# EAGLE design 2023-12-16 LVMi-IonPump-Controller (EAGLE 9.6.2)
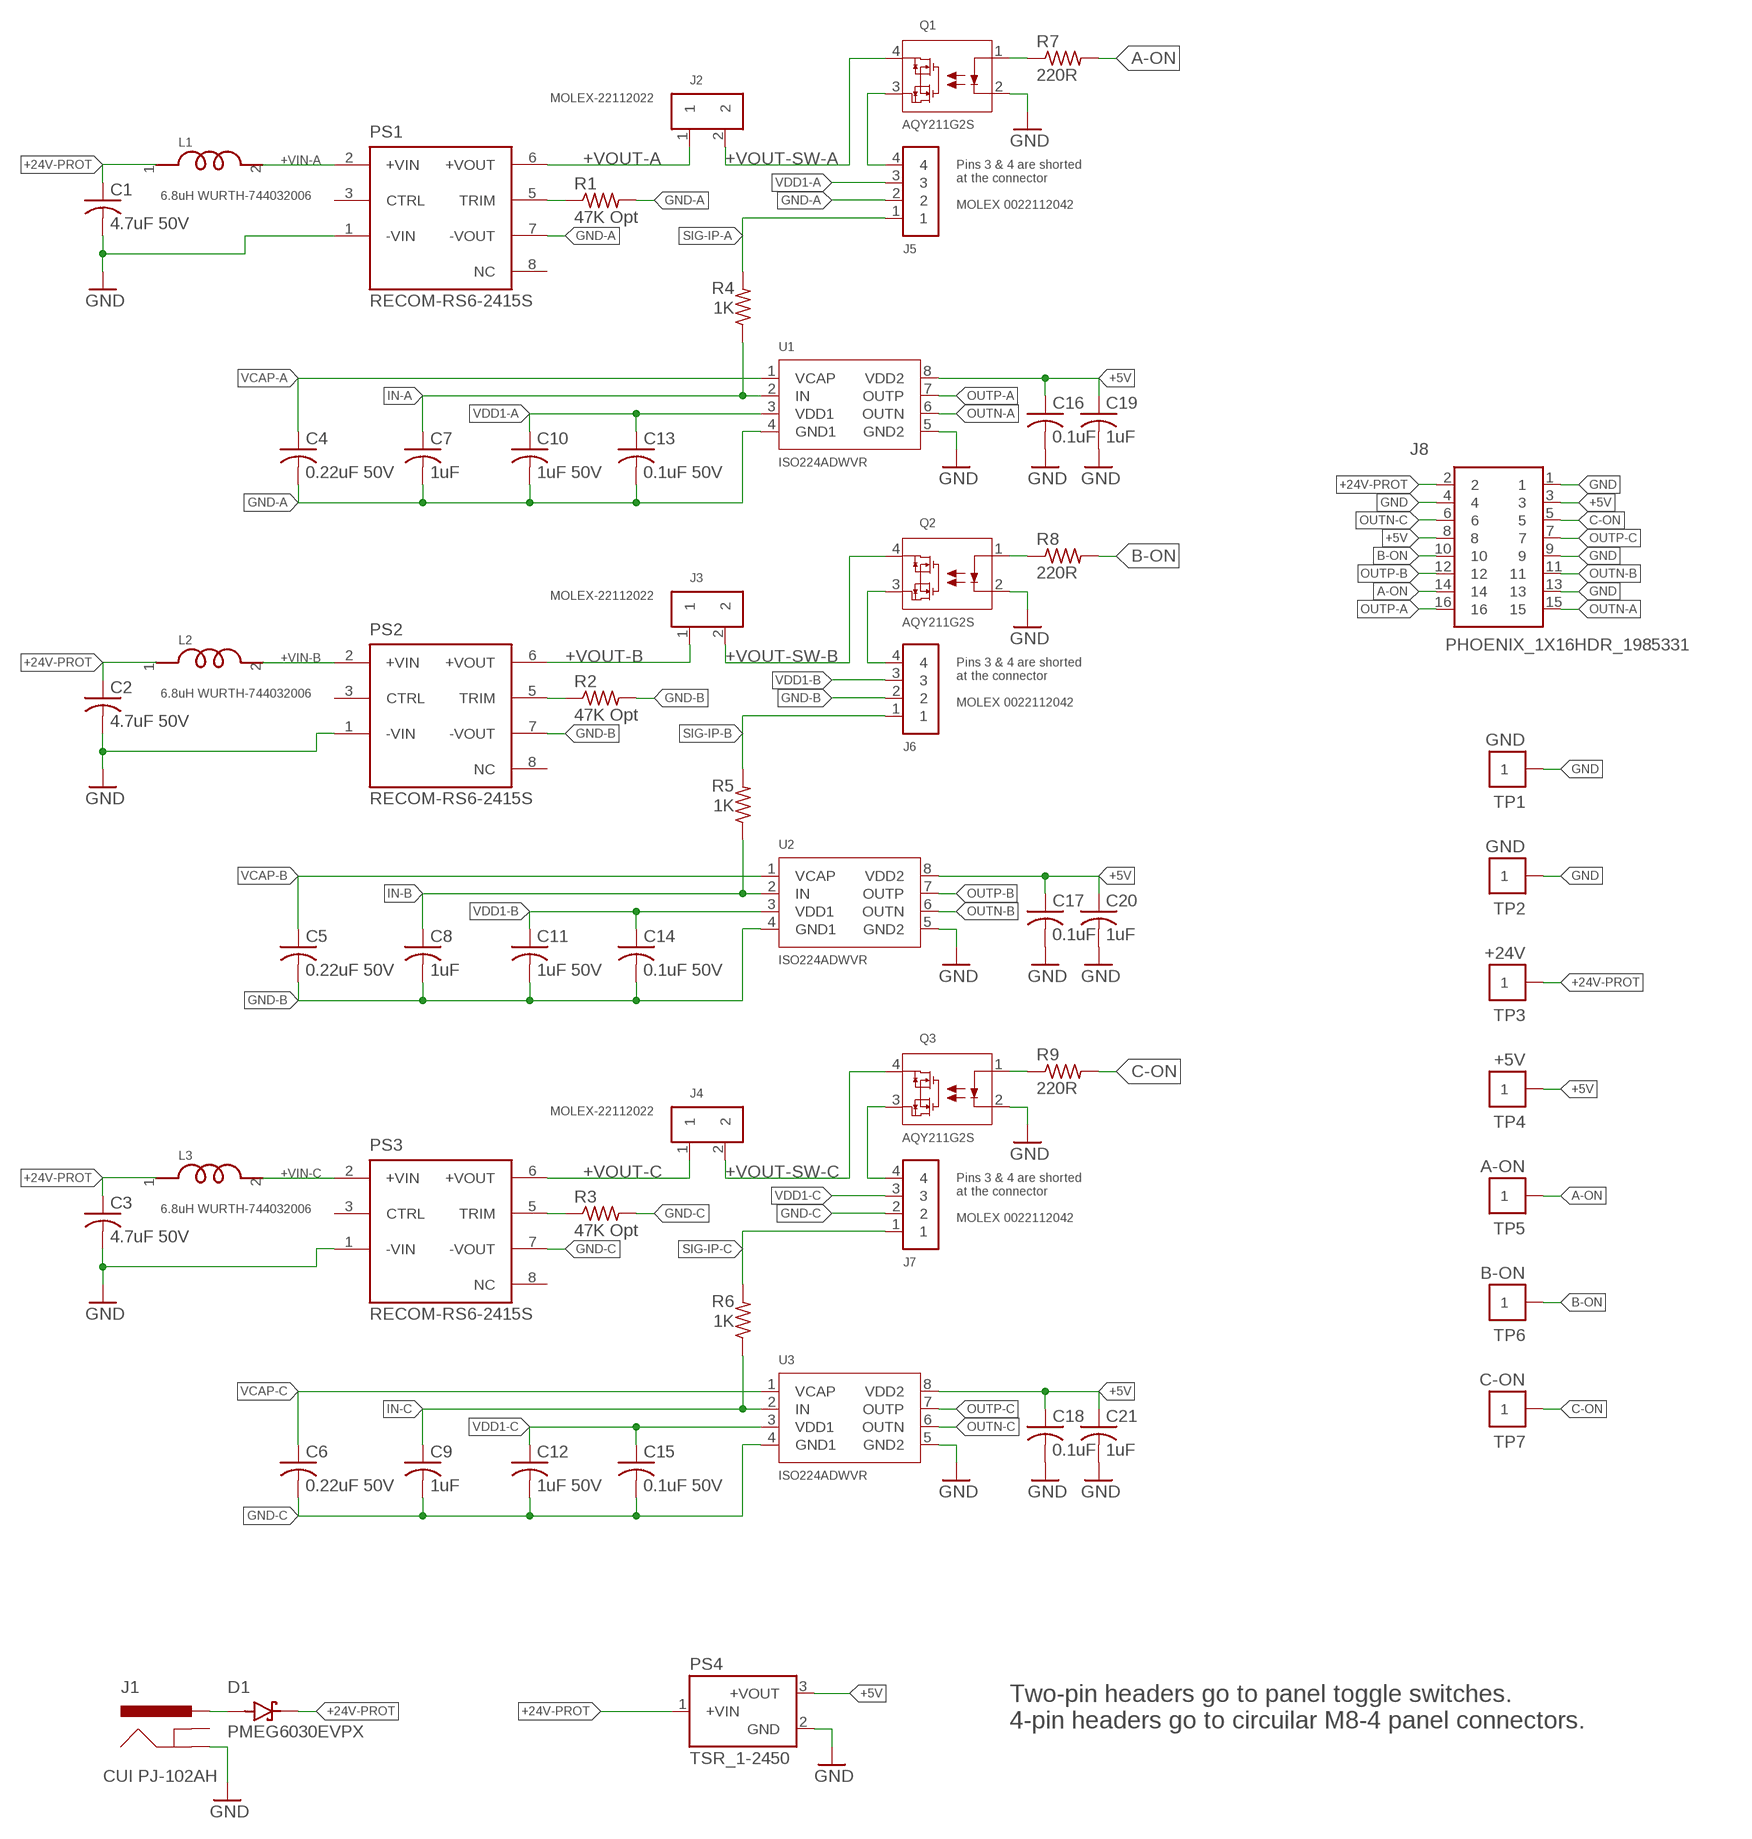
[diagram p0: schematic, sheet 1]

## Parts
C1  4.7uF 50V  C-USC0805  [C0805]
C2  4.7uF 50V  C-USC0805  [C0805]
C3  4.7uF 50V  C-USC0805  [C0805]
C4  0.22uF 50V  C-USC0805  [C0805]
C5  0.22uF 50V  C-USC0805  [C0805]
C6  0.22uF 50V  C-USC0805  [C0805]
C7  1uF  C-USC0805  [C0805]
C8  1uF  C-USC0805  [C0805]
C9  1uF  C-USC0805  [C0805]
C10  1uF 50V  C-USC0805  [C0805]
C11  1uF 50V  C-USC0805  [C0805]
C12  1uF 50V  C-USC0805  [C0805]
C13  0.1uF 50V  C-USC0805  [C0805]
C14  0.1uF 50V  C-USC0805  [C0805]
C15  0.1uF 50V  C-USC0805  [C0805]
C16  0.1uF  C-USC0805  [C0805]
C17  0.1uF  C-USC0805  [C0805]
C18  0.1uF  C-USC0805  [C0805]
C19  1uF  C-USC0805  [C0805]
C20  1uF  C-USC0805  [C0805]
C21  1uF  C-USC0805  [C0805]
D1  PMEG6030EVPX  SCHOTTKY-PMEG6030EVPX  [DIO_PMEG6030EVPX]
J1  CUI PJ-102AH  POWER_JACKPJ-102AH  [PJ-102AH]
J2  MOLEX-22112022  PINHD-1X2-MOLEX-22112022  [1X02-MOLEX-22112022]
J3  MOLEX-22112022  PINHD-1X2-MOLEX-22112022  [1X02-MOLEX-22112022]
J4  MOLEX-22112022  PINHD-1X2-MOLEX-22112022  [1X02-MOLEX-22112022]
J5  MOLEX 0022112042  PINHD-1X4-MOLEX-22112042  [1X04-MOLEX-22112042]
J6  MOLEX 0022112042  PINHD-1X4-MOLEX-22112042  [1X04-MOLEX-22112042]
J7  MOLEX 0022112042  PINHD-1X4-MOLEX-22112042  [1X04-MOLEX-22112042]
J8  PHOENIX_1X16HDR_1985331  [1985331]
L1  6.8uH WURTH-744032006  INDUCTOR-WURTH-744032006  [WURTH-1210-INDUCTOR]
L2  6.8uH WURTH-744032006  INDUCTOR-WURTH-744032006  [WURTH-1210-INDUCTOR]
L3  6.8uH WURTH-744032006  INDUCTOR-WURTH-744032006  [WURTH-1210-INDUCTOR]
PS1  RECOM-RS6-2415S  DC-DC-15V-RECOM-RS6-2415S  [CONV_RS6-2415S]
PS2  RECOM-RS6-2415S  DC-DC-15V-RECOM-RS6-2415S  [CONV_RS6-2415S]
PS3  RECOM-RS6-2415S  DC-DC-15V-RECOM-RS6-2415S  [CONV_RS6-2415S]
PS4  TSR_1-2450  [CONV_TSR_1-2450]
Q1  AQY211G2S  AQY212GSX  [SOP4_PAN]
Q2  AQY211G2S  AQY212GSX  [SOP4_PAN]
Q3  AQY211G2S  AQY212GSX  [SOP4_PAN]
R1  47K Opt  R-US_R0805  [R0805]
R2  47K Opt  R-US_R0805  [R0805]
R3  47K Opt  R-US_R0805  [R0805]
R4  1K  R-US_R0805  [R0805]
R5  1K  R-US_R0805  [R0805]
R6  1K  R-US_R0805  [R0805]
R7  220R  R-US_R0805  [R0805]
R8  220R  R-US_R0805  [R0805]
R9  220R  R-US_R0805  [R0805]
TP1  GND  TP5000-TESTPOINT-BLK  [TP5000-TESTPOINT-BLK]
TP2  GND  TP5000-TESTPOINT-BLK  [TP5000-TESTPOINT-BLK]
TP3  +24V  TP5000-TESTPOINT-BLK  [TP5000-TESTPOINT-BLK]
TP4  +5V  TP5000-TESTPOINT-BLK  [TP5000-TESTPOINT-BLK]
TP5  A-ON  TP5000-TESTPOINT-BLK  [TP5000-TESTPOINT-BLK]
TP6  B-ON  TP5000-TESTPOINT-BLK  [TP5000-TESTPOINT-BLK]
TP7  C-ON  TP5000-TESTPOINT-BLK  [TP5000-TESTPOINT-BLK]
U1  ISO224ADWVR  [DWV8_TEX]
U2  ISO224ADWVR  [DWV8_TEX]
U3  ISO224ADWVR  [DWV8_TEX]

## Nets
+5V: C16.1 C17.1 C18.1 C19.1 C20.1 C21.1 J8.3 J8.8 PS4.3(+VOUT) TP4.P$1 U1.8(VDD2) U2.8(VDD2) U3.8(VDD2)
+24V: D1.2(A) J1.PWR
+24V-PROT: C1.1 C2.1 C3.1 D1.1(K) J8.2 L1.1 L2.1 L3.1 PS4.1(+VIN) TP3.P$1
+VIN-A: L1.2 PS1.2(+VIN)
+VIN-B: L2.2 PS2.2(+VIN)
+VIN-C: L3.2 PS3.2(+VIN)
+VOUT-A: J2.1 PS1.6(+VOUT)
+VOUT-B: J3.1 PS2.6(+VOUT)
+VOUT-C: J4.1 PS3.6(+VOUT)
+VOUT-SW-A: J2.2 Q1.4
+VOUT-SW-B: J3.2 Q2.4
+VOUT-SW-C: J4.2 Q3.4
A-ON: J8.14 R7.2 TP5.P$1
B-ON: J8.10 R8.2 TP6.P$1
C-ON: J8.5 R9.2 TP7.P$1
GND: C1.2 C2.2 C3.2 C16.2 C17.2 C18.2 C19.2 C20.2 C21.2 J1.GND J8.1 J8.4 J8.9 J8.13 PS1.1(-VIN) PS2.1(-VIN) PS3.1(-VIN) PS4.2(GND) Q1.2 Q2.2 Q3.2 TP1.P$1 TP2.P$1 U1.5(GND2) U2.5(GND2) U3.5(GND2)
GND-A: C4.2 C7.2 C10.2 C13.2 J5.2 PS1.7(-VOUT) R1.2 U1.4(GND1)
GND-B: C5.2 C8.2 C11.2 C14.2 J6.2 PS2.7(-VOUT) R2.2 U2.4(GND1)
GND-C: C6.2 C9.2 C12.2 C15.2 J7.2 PS3.7(-VOUT) R3.2 U3.4(GND1)
IN-A: C7.1 R4.1 U1.2(IN)
IN-B: C8.1 R5.1 U2.2(IN)
IN-C: C9.1 R6.1 U3.2(IN)
N$1: Q3.1 R9.1
N$2: Q1.1 R7.1
N$3: Q2.1 R8.1
N$4: PS3.5(TRIM) R3.1
N$5: PS2.5(TRIM) R2.1
N$6: PS1.5(TRIM) R1.1
OUTN-A: J8.15 U1.6(OUTN)
OUTN-B: J8.11 U2.6(OUTN)
OUTN-C: J8.6 U3.6(OUTN)
OUTP-A: J8.16 U1.7(OUTP)
OUTP-B: J8.12 U2.7(OUTP)
OUTP-C: J8.7 U3.7(OUTP)
SIG-IP-A: J5.1 R4.2
SIG-IP-B: J6.1 R5.2
SIG-IP-C: J7.1 R6.2
VCAP-A: C4.1 U1.1(VCAP)
VCAP-B: C5.1 U2.1(VCAP)
VCAP-C: C6.1 U3.1(VCAP)
VDD1-A: C10.1 C13.1 J5.3 U1.3(VDD1)
VDD1-B: C11.1 C14.1 J6.3 U2.3(VDD1)
VDD1-C: C12.1 C15.1 J7.3 U3.3(VDD1)
VOUT-RL-A: J5.4 Q1.3
VOUT-RL-B: J6.4 Q2.3
VOUT-RL-C: J7.4 Q3.3
Unconnected: J1.GNDBRK(GNDBREAK) PS1.3(CTRL) PS1.8(NC) PS2.3(CTRL) PS2.8(NC) PS3.3(CTRL) PS3.8(NC)

## Notes on the sheet
- Pins 3 & 4 are shorted
  at the connector
- Pins 3 & 4 are shorted
  at the connector
- Pins 3 & 4 are shorted
  at the connector
- Two-pin headers go to panel toggle switches.
  4-pin headers go to circuilar M8-4 panel connectors.

## Library data of the parts
C1-C21 = AUmlib:C-US: CAPACITOR, American symbol; SPICEPREFIX: C
D1 = AUmlib:SCHOTTKY-PMEG6030EVPX: PMEG6030 Series 60 V 3 A Surface Mount Schottky Barrier Rectifier - SOD-128; DESCRIPTION: Diode Schottky 60V 3A Surface Mount SOD-128/CFP5; DIGI-KEY_PART_NUMBER: 1727-1349-1-ND; MF: Nexperia USA; MP: PMEG6030EVPX; PACKAGE: CFP5-2 Nexperia USA Inc.; PURCHASE-URL: https://pricing.snapeda.com/search/part/PMEG6030EVPX/?ref=eda
J1 = AUmlib:POWER_JACK: Power Jack Connector The CUI PJ-102AH has smaller tabs and a 2.1 mm opening for a 2.0 mm pin. This is the standard 5.5mm barrel jack for power. The PTH is the most common, proven, reliable, footprint. The Slot footprint only works if the mill layer is transmitted to the PCB fab house so be warned. Here are the connectors we sell at SparkFun: DC Barrel Power Jack/Connector <https://www.sparkfun.com/products/119> (PRT-00119) DC Barrel Power Jack/Connector (SMD) <https://www.sparkfun.com/products/12748> (PRT-12748) DC Barrel Jack Adapter - Breadboard Compatible <https://www.sparkfun.com/products/10811> (PRT-10811) It is used on this SparkFun product (and many, many others): SparkFun RedBoard - Programmed with Arduino <https://www.sparkfun.com/products/12757> (DEV-12757) Also, if you need a mating power supply or connector, please check these out: Wall Adapter Power Supply - 9VDC 650mA <https://www.sparkfun.com/products/298> (TOL-00298) DC Barrel Jack Adapter - Male <https://www.sparkfun.com/products/10287> (PRT-10287)
J2-J4 = AUmlib:PINHD-1X2-MOLEX-22112022
J5-J7 = AUmlib:PINHD-1X4-MOLEX-22112042
J8 = AUmlib:PHOENIX_1X16HDR_1985331: PTSA 1,5/16-3,5-Z Source: Datasheet <https://datasheet.datasheetarchive.com/originals/distributors/SFDatasheet-2/sf-00059086.pdf>; DESCRIPTION: PTSA 1,5/16-3,5-Z; HEIGHT: 13.1mm; MANUFACTURER_NAME: Phoenix Contact; MANUFACTURER_PART_NUMBER: 1985331; MOUSER_PART_NUMBER: 651-1985331; MOUSER_PRICE-STOCK: https://www.mouser.co.uk/ProductDetail/Phoenix-Contact/1985331?qs=uD%2FdkN7XIa2gzzUd7QLZ1Q%3D%3D
L1-L3 = AUmlib:INDUCTOR-WURTH-744032006
PS1-PS3 = AUmlib:DC-DC-15V-RECOM-RS6-2415S: 6 Watt SIP8 Single and Dual Output; DESCRIPTION: 6W DC/DC-Converter 'ECONOLINE' SIP8 2kV reg 2:1; DIGI-KEY_PART_NUMBER: 945-2987-ND; MF: Recom Power; MP: RS6-2415S; PACKAGE: SIP-8 Recom Power; PURCHASE-URL: https://pricing.snapeda.com/search/part/RS6-2415S/?ref=eda
PS4 = AUmlib:TSR_1-2450; MANUFACTURER: Traco Power; MAXIMUM_PACKAGE_HEIGHT: 10.6mm; PARTREV: Apr 27, 2020; STANDARD: Manufacturer Recommendations
Q1-Q3 = AUmlib:AQY212GSX; COPYRIGHT: Copyright (C) 2023 Ultra Librarian. All rights reserved.; MANUFACTURER_PART_NUMBER: AQY212GSX; MFR_NAME: Panasonic
R1-R9 = AUmlib:R-US_: RESISTOR, American symbol; SPICEPREFIX: R
TP1-TP7 = AUmlib:TP5000-TESTPOINT-BLK: TEST POINT
U1-U3 = AUmlib:ISO224ADWVR; BUILT_BY: EMA_Jessica; COPYRIGHT: Copyright (C) 2018 Accelerated Designs. All rights reserved; MANUFACTURER_PART_NUMBER: ISO224ADWVR; SOURCELIBRARY: TI_2020-05-18; VENDOR: Texas Instruments

## Board
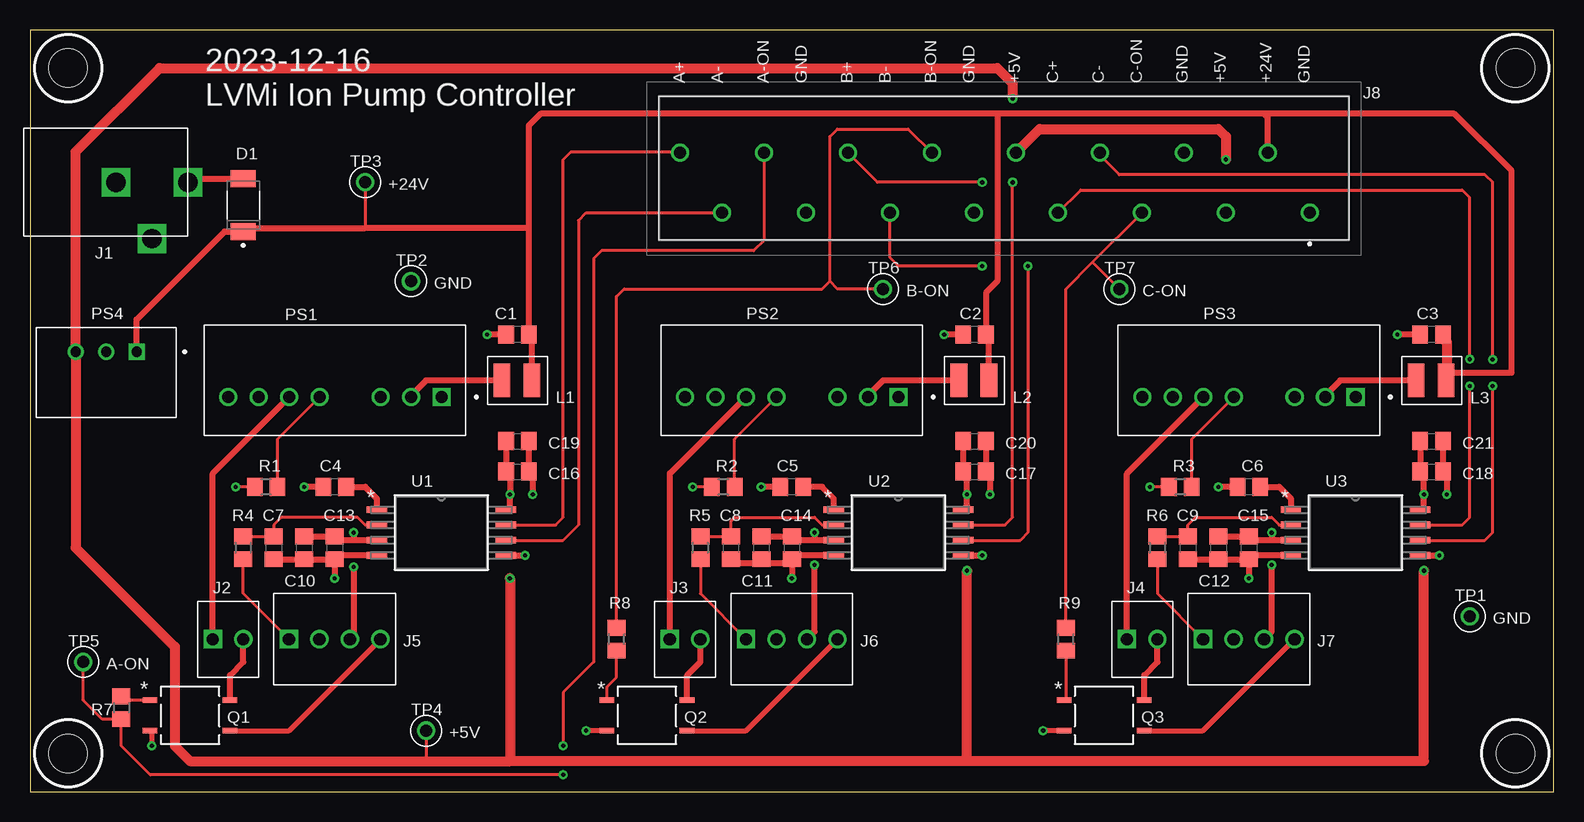
[diagram p1: board, top side]
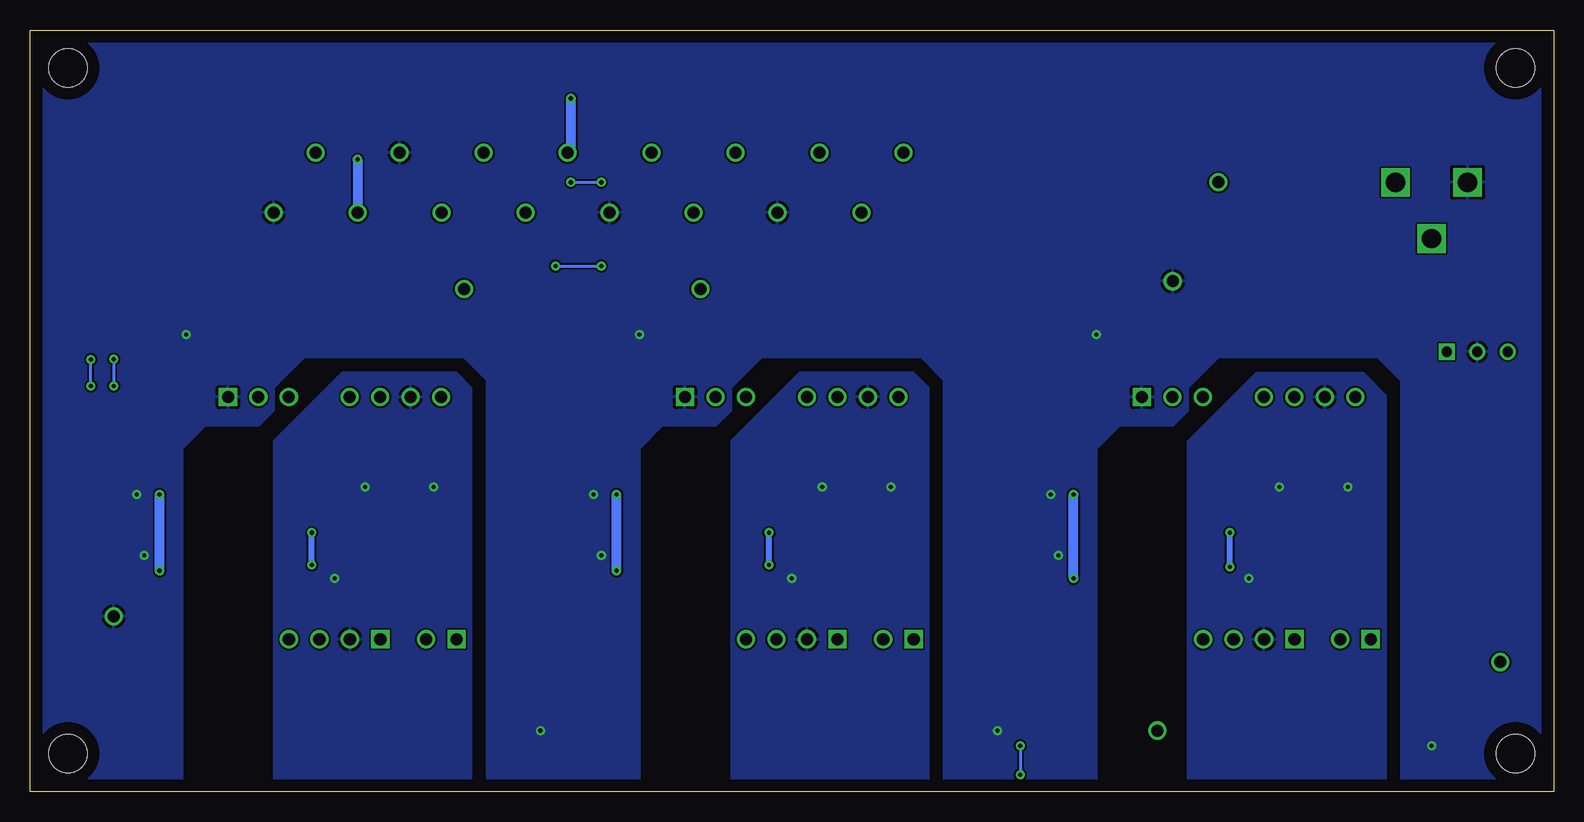
[diagram p2: board, bottom side, seen from below]

Size 127 x 63.5 mm. Coordinates in mm from the lower left corner, seen from the top.
Outline: 0,0 127,0 127,63.5 0,63.5 0,0
Copper layers (1*16): Top 0.035mm / dielectric 1.5mm / Bottom 0.035mm
Design rules "default": minimum track width 6mil, minimum drill 0.35mm, track to track 6mil, track to pad 6mil, pad to pad 6mil, via to via 6mil, smd to smd 6mil, copper to edge 40mil, drill to drill 6mil, minimum pad ring 10mil, minimum via ring 8mil, stop-mask expansion 4mil, vias tented up to drill 0mil, thermal gap 10mil
Holes 3.17 mm at 3.17,3.17 123.83,3.17 123.83,60.33 3.17,60.33

### Footprints (pad centres in the part's own frame; a part is rotated, then mirrored left to right if it is on the bottom)
C0805 = smd 1.3 x 1.5: 1 -0.95,0; 2 0.95,0
DIO_PMEG6030EVPX = smd 1.4 x 2.1: 1 -2.2,0; 2 2.2,0
PJ-102AH = drill 1.6 square: GND 0,3; GNDBRK -4.7,0; PWR 0,-3
1X02-MOLEX-22112022 = drill 1.016 square: 1 -1.27,0 | drill 1.016: 2 1.27,0
1X04-MOLEX-22112042 = drill 1.016 square: 1 0,0 | drill 1.016: 2 2.54,0; 3 5.08,0; 4 7.62,0
1985331 = drill 1 pad 1.5: 1 0,0; 2 3.5,-5; 3 7,0; 4 10.5,-5; 5 14,0; 6 17.5,-5; 7 21,0; 8 24.5,-5; 9 28,0; 10 31.5,-5; 11 35,0; 12 38.5,-5; 13 42,0; 14 45.5,-5; 15 49,0; 16 52.5,-5
WURTH-1210-INDUCTOR = smd 1.4 x 2.8: 1 -1.2,0; 2 1.3,0
CONV_RS6-2415S = drill 1 square: 1 -8.9,1.4 | drill 1: 2 -6.36,1.4; 3 -3.82,1.4; 5 1.26,1.4; 6 3.8,1.4; 7 6.34,1.4; 8 8.88,1.4
CONV_TSR_1-2450 = drill 0.85 square: 1 -2.54,-1.75 | drill 0.85: 2 0,-1.75; 3 2.54,-1.75
SOP4_PAN = smd 1.219 x 0.457: 1 -3.34,1.27; 2 -3.34,-1.27; 3 3.34,-1.27; 4 3.34,1.27
R0805 = smd 1.3 x 1.5: 1 -0.95,0; 2 0.95,0
TP5000-TESTPOINT-BLK = drill 1: P$1 0,0
DWV8_TEX = smd 1.702 x 0.559: 1 -5.385,1.905; 2 -5.385,0.635; 3 -5.385,-0.635; 4 -5.385,-1.905; 5 5.385,-1.905; 6 5.385,-0.635; 7 5.385,0.635; 8 5.385,1.905

### Placement (x,y rotation side)
C1  40.64,38.1 180 top
C2  78.74,38.1 180 top
C3  116.84,38.1 180 top
C4  25.4,25.4 180 top
C5  63.5,25.4 180 top
C6  101.6,25.4 180 top
C7  20.32,20.32 270 top
C8  58.42,20.32 270 top
C9  96.52,20.32 270 top
C10  22.86,20.32 270 top
C11  60.96,20.32 270 top
C12  99.06,20.32 270 top
C13  25.4,20.32 270 top
C14  63.5,20.32 270 top
C15  101.6,20.32 270 top
C16  40.64,26.67 0 top
C17  78.74,26.67 0 top
C18  116.84,26.67 0 top
C19  40.64,29.21 0 top
C20  78.74,29.21 0 top
C21  116.84,29.21 0 top
D1  17.78,48.9 90 top
J1  10.16,50.8 90 top
J2  16.51,12.7 0 top
J3  54.61,12.7 0 top
J4  92.71,12.7 0 top
J5  21.59,12.7 0 top
J6  59.69,12.7 0 top
J7  97.79,12.7 0 top
J8  106.68,48.26 180 top
L1  40.64,34.29 180 top
L2  78.74,34.29 180 top
L3  116.84,34.29 180 top
PS1  25.4,34.29 180 top
PS2  63.5,34.29 180 top
PS3  101.6,34.29 180 top
PS4  6.35,34.92 180 top
Q1  13.34,6.35 0 top
Q2  51.44,6.35 0 top
Q3  89.53,6.35 0 top
R1  19.68,25.4 180 top
R2  57.78,25.4 180 top
R3  95.89,25.4 180 top
R4  17.78,20.32 270 top
R5  55.88,20.32 270 top
R6  93.98,20.32 270 top
R7  7.62,6.99 270 top
R8  48.9,12.7 90 top
R9  86.36,12.7 90 top
TP1  120.02,14.61 0 top
TP2  31.75,42.55 0 top
TP3  27.94,50.8 0 top
TP4  33.02,5.08 0 top
TP5  4.45,10.79 0 top
TP6  71.12,41.91 0 top
TP7  90.81,41.91 0 top
U1  34.29,21.59 0 top
U2  72.39,21.59 0 top
U3  110.49,21.59 0 top

### Tracks (layer width: path | path; a pad name or v marks a point on that pad's centre or on a via)
+5V  (via drill 0.35)
  Top 0.254: TP4.P$1 33.02,2.54
  Top 0.508: C20.1 C17.1 78.11,26.36 v78.11,24.77 78.11,23.82 U2.8 | C19.1 C16.1 40.01,26.36 v40.01,24.77 40.01,23.82 U1.8 | C21.1 C18.1 116.2,26.36 v116.2,24.77 116.2,23.5 U3.8
  Top 0.813: 78.11,2.54 116.2,2.54 v116.2,18.41 | 78.11,2.54 40.01,2.54 | 78.11,2.54 v78.11,18.41 | 40.01,2.54 33.02,2.54 13.34,2.54 12.06,3.81 12.06,12.06 3.81,20.32 PS4.3 3.81,53.34 10.79,60.33 80.64,60.33 81.92,59.05 v81.92,57.78 | v40.01,17.78 40.01,2.54 | J8.8 84.17,55.24 99.06,55.24 99.69,54.61 v99.69,52.7
  Bottom 0.813: v40.01,17.78 v40.01,24.77 | v78.11,18.41 v78.11,24.77 | v116.2,18.41 v116.2,24.77 | J8.8 81.92,53.52 v81.92,57.78 | v99.69,52.7 99.69,48.27 J8.3
+24V
  Top 0.508: J1.PWR 13.46,51.09 D1.2
+24V-PROT
  Top 0.254: TP3.P$1 27.94,46.99
  Top 0.508: 41.59,46.99 C1.1 41.84,37.85 L1.1 | 41.59,46.99 41.59,55.56 42.55,56.52 80.64,56.52 | 102.87,56.52 118.75,56.52 123.5,51.76 123.5,34.92 118.11,34.92 118.04,34.85 L3.1 | 102.87,56.52 80.64,56.52 | 80.64,56.52 80.64,42.55 79.69,41.59 C2.1 79.94,37.85 L2.1 | C3.1 117.79,37.78 | 41.59,46.99 27.94,46.99 17.78,46.99 D1.1 16.21,46.7 8.89,39.37 PS4.1 | J8.2 103.18,56.2 102.87,56.52
  Top 0.813: 117.79,37.78 118.11,37.47 118.11,34.36 L3.1
+VIN-A
  Top 0.508: L1.2 33.02,34.29 31.76,33.03 PS1.2
+VIN-B
  Top 0.508: L2.2 71.12,34.29 69.86,33.03 PS2.2
+VIN-C
  Top 0.508: L3.2 109.22,34.29 107.96,33.03 PS3.2
+VOUT-A
  Top 0.508: J2.1 15.24,26.53 PS1.6
+VOUT-B
  Top 0.508: J3.1 53.34,26.53 PS2.6
+VOUT-C
  Top 0.508: J4.1 91.44,26.53 PS3.6
+VOUT-SW-A
  Top 0.508: Q1.4 16.68,9.69 17.78,10.79 J2.2
+VOUT-SW-B
  Top 0.508: Q2.4 54.77,9.69 55.88,10.79 J3.2
+VOUT-SW-C
  Top 0.508: Q3.4 92.88,9.69 93.98,10.79 J4.2
A-ON  (via drill 0.35)
  Top 0.254: J8.14 61.18,45.94 60.33,45.09 47.62,45.09 46.99,44.45 46.99,10.79 44.45,8.26 v44.45,3.81 | v44.45,1.39 10.04,1.39 7.62,3.81 R7.2 6.03,6.04 4.45,7.62 TP5.P$1
  Bottom 0.254: v44.45,3.81 v44.45,1.39
B-ON
  Top 0.254: 66.67,42.55 66.04,41.91 49.53,41.91 48.9,41.27 R8.2 | 66.67,42.55 66.67,54.61 67.31,55.24 73.19,55.24 J8.10 | TP6.P$1 67.31,41.91 66.67,42.55
C-ON
  Top 0.254: J8.5 92.68,48.23 88.58,44.13 | 88.58,44.13 86.36,41.91 R9.2 | TP7.P$1 88.58,44.13
GND  (via drill 0.35)
  Top 0.406: Q1.2 10.16,4.92 v10.16,3.81 | Q2.2 v46.35,5.08 | Q3.2 v84.45,5.08
  Top 0.508: C19.2 C16.2 41.91,26.35 41.91,26.04 v41.91,24.77 | C20.2 C17.2 80.01,26.35 v80.01,24.77 | C21.2 C18.2 118.11,26.35 v118.11,24.77 | U1.5 v41.27,19.68 | C1.2 v38.1,38.1 | C2.2 v76.2,38.1 | C3.2 v113.98,38.1 | U2.5 v79.38,19.68 | U3.5 v117.47,19.68
  pour Bottom: 0,0 12.7,0 12.7,34.25 14.65,36.2 27.94,36.2 30.48,33.66 30.48,31.75 31.75,30.48 36.2,30.48 38.1,28.57 38.1,0 50.8,0 50.8,34.29 52.7,36.2 66.04,36.2 68.58,33.66 68.58,31.75 69.85,30.48 74.3,30.48 76.2,28.57 76.2,0 88.9,0 88.9,34.29 90.81,36.2 104.14,36.2 106.68,33.66 106.68,31.75 107.95,30.48 112.39,30.48 114.3,28.57 114.3,0 127,0 127,63.5 0,63.5
GND-A  (via drill 0.35)
  Top 0.254: R1.2 v17.14,25.4
  Top 0.508: C7.2 C10.2 C13.2 | U1.4 25.71,19.68 C13.2 | C4.2 v22.86,25.4 | C13.2 v25.4,17.78
  pour Bottom: 30.48,0 30.48,29.21 24.77,34.92 15.88,34.92 13.97,33.02 13.97,0
GND-B  (via drill 0.35)
  Top 0.254: R2.2 v55.24,25.4
  Top 0.508: 63.5,19.05 C14.2 63.5,19.68 U2.4 | 63.5,19.05 v63.5,17.78 | 63.5,19.05 61.28,19.05 C11.2 60.64,19.05 58.42,19.05 C8.2 | C5.2 v60.96,25.4
  pour Bottom: 52.07,0 52.07,33.66 53.34,34.92 62.87,34.92 68.58,29.21 68.58,0
GND-C  (via drill 0.35)
  Top 0.254: R3.2 v93.34,25.4
  Top 0.508: C6.2 v99.06,25.4 | C15.2 C12.2 C9.2 | C15.2 v101.6,17.78 | U3.4 101.6,19.68 C15.2
  pour Bottom: 90.17,0 90.17,33.66 91.44,34.92 100.97,34.92 106.68,29.21 106.68,0
IN-A
  Top 0.254: R4.1 C7.1 20.32,22.23 20.95,22.86 27.3,22.86 27.94,22.23 U1.2
IN-B
  Top 0.254: R5.1 C8.1 58.42,22.54 58.74,22.86 65.41,22.86 66.04,22.23 U2.2
IN-C
  Top 0.254: U3.2 104.14,22.23 103.5,22.86 97.16,22.86 96.52,22.23 C9.1 R6.1
N$1
  Top 0.254: R9.1 86.36,7.79 Q3.1
N$2
  Top 0.254: Q1.1 7.93,7.62 R7.1
N$3
  Top 0.254: Q2.1 48.09,8.72 48.9,9.53 R8.1
N$4
  Top 0.254: R3.1 96.83,29.39 PS3.5
N$5
  Top 0.254: R2.1 58.73,29.39 PS2.5
N$6
  Top 0.254: R1.1 20.64,29.39 PS1.5
OUTN-A
  Top 0.254: U1.6 44.45,20.95 45.72,22.23 45.72,47.62 46.35,48.26 J8.15
OUTN-B  (via drill 0.35)
  Top 0.254: U2.6 82.55,20.95 83.19,21.59 v83.19,43.81 | v79.38,43.81 72.39,43.81 71.68,44.52 J8.11
  Bottom 0.254: v83.19,43.81 v79.38,43.81
OUTN-C  (via drill 0.35)
  Top 0.254: U3.6 121.28,20.95 121.92,21.59 v121.92,33.8 | v121.92,36.03 121.92,50.8 121.28,51.44 90.81,51.44 89.18,53.06 J8.6
  Bottom 0.254: v121.92,33.8 v121.92,36.03
OUTP-A
  Top 0.254: U1.7 43.81,22.23 44.45,22.86 44.45,52.7 45.09,53.34 54.1,53.34 J8.16
OUTP-B  (via drill 0.35)
  Top 0.254: U2.7 81.28,22.23 81.92,22.86 v81.92,50.8 | v79.38,50.8 70.64,50.8 J8.12
  Bottom 0.254: v81.92,50.8 v79.38,50.8
OUTP-C  (via drill 0.35)
  Top 0.254: U3.7 119.38,22.23 120.02,22.86 v120.02,33.8 | v120.02,36.05 120.02,49.53 119.38,50.16 87.58,50.16 J8.7
  Bottom 0.254: v120.02,36.05 v120.02,33.8
SIG-IP-A
  Top 0.254: J5.1 17.78,16.51 R4.2
SIG-IP-B
  Top 0.254: R5.2 55.88,16.51 J6.1
SIG-IP-C
  Top 0.254: R6.2 93.98,16.51 J7.1
VCAP-A
  Top 0.508: C4.1 27.94,25.4 28.91,24.43 U1.1
VCAP-B
  Top 0.508: U2.1 67,24.43 66.04,25.4 C5.1
VCAP-C
  Top 0.508: C6.1 104.14,25.4 105.11,24.43 U3.1
VDD1-A  (via drill 0.35)
  Top 0.508: C10.1 C13.1 25.71,20.95 26.99,20.95 | U1.3 26.99,20.95 | J5.3 26.99,13.02 v26.99,18.73 | v26.99,21.59 26.99,20.95
  Bottom 0.508: v26.99,18.73 v26.99,21.59
VDD1-B  (via drill 0.35)
  Top 0.508: C11.1 C14.1 63.81,20.95 65.41,20.95 | U2.3 65.41,20.95 | J6.3 65.41,13.34 v65.41,18.9 | v65.41,21.59 65.41,20.95
  Bottom 0.508: v65.41,18.9 v65.41,21.59
VDD1-C  (via drill 0.35)
  Top 0.508: U3.3 103.5,20.95 | 103.5,20.95 101.92,20.95 C15.1 C12.1 | J7.3 103.5,13.34 v103.5,18.9 | v103.5,21.59 103.5,20.95
  Bottom 0.508: v103.5,18.9 v103.5,21.59
VOUT-RL-A
  Top 0.406: Q1.3 21.59,5.08 J5.4
VOUT-RL-B
  Top 0.406: Q2.3 59.69,5.08 J6.4
VOUT-RL-C
  Top 0.406: Q3.3 97.79,5.08 J7.4

### Text on the board
tPlace: A+ | A- | A-ON | GND | B+ | B- | B-ON | GND | +5V | C+ | C- | C-ON | GND | +5V | +24V | GND | 2023-12-16 / LVMi Ion Pump Controller